# EAGLE design PRY237 - Laser Rec (EAGLE 8.3.2)
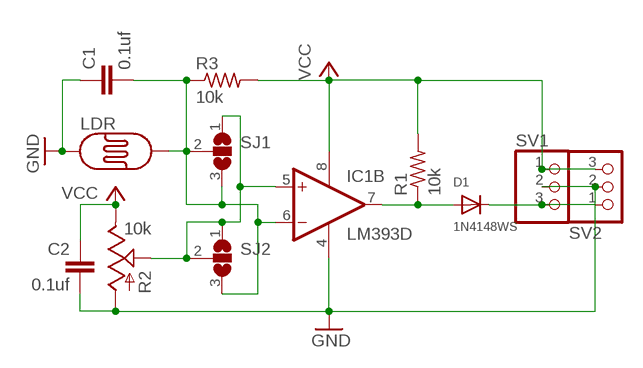
[diagram p0: schematic, sheet 1]

## Parts
C1  0.1uf  C-EUC0805  [C0805]
C2  0.1uf  C-EUC0805  [C0805]
D1  1N4148WS  DIODESOD-323F  [SOD-323F]
IC1  LM393D  [SO08]
LDR  PHOTOCELLPTH  [PHOTOCELL]
R1  10k  R-US_M0805  [M0805]
R2  10k  TRIM_US-CT6  [CT6]
R3  10k  R-US_M0805  [M0805]
SJ1  SJ2W  [SJ_2]
SJ2  SJ2W  [SJ_2]
SV1  PINHD-1X3  [1X03]
SV2  PINHD-1X3  [1X03]

## Nets
GND: C1.1 C2.2 IC1.4(P:V-) LDR.1 R2.A SV1.2 SV2.2
N$1: IC1.5(B:+IN) R2.S SJ1.1 SJ2.1 SJ2.2
N$2: D1.C SV1.3 SV2.1
N$3: D1.A IC1.7(B:OUT) R1.1
N$4: C1.2 IC1.6(B:-IN) LDR.2 R3.1 SJ1.2 SJ1.3 SJ2.3
VCC: C2.1 IC1.8(P:V+) R1.2 R2.E R3.2 SV1.1 SV2.3
Unconnected: IC1.1(A:OUT) IC1.2(A:-IN) IC1.3(A:+IN)

## Library data of the parts
C1 C2 = rcl:C-EU: CAPACITOR, European symbol
D1 = adafruit:DIODE: Diode SMADIODE - SMA Surface Mount Package 20V 1A Schottky Diode Digikey: 641-1014-6-ND DO-1N4148 - Through Hole Small Current Diode SOD-123 20V 1 A (.5mV Vf) Schottky Diode - Digikey: MBRX120TPMSCT-ND SOD-323 10V 570mA (.38mV Vf, 3ns) Schottky Diode - Digikey: ZLLS410CT-ND SOD-523 30V 30mA Schottky Diode (RB751S-40TE61) - Digikey: RB751S-40TE61CT-ND SOT23-R/W - SOT23 Package (R = Solder Paste/Reflow Ovens, W = Hand-Soldering) BAT54Film 40V 300mA - Digikey: 497-7162-1-ND
IC1 = linear:LM393: COMPARATOR
LDR = SparkFun-Sensors:PHOTOCELL: CdS photoresistor. This is a low cost way to detect light levels. Resistance decreases with more incoming light. SparkFun SKU: SEN-09088
R1 R3 = rcl:R-US_: RESISTOR, American symbol
R2 = pot:TRIM_US-: POTENTIOMETER
SJ1 SJ2 = jumper:SJ2W: SMD solder JUMPER
SV1 SV2 = pinhead:PINHD-1X3: PIN HEADER

## Board
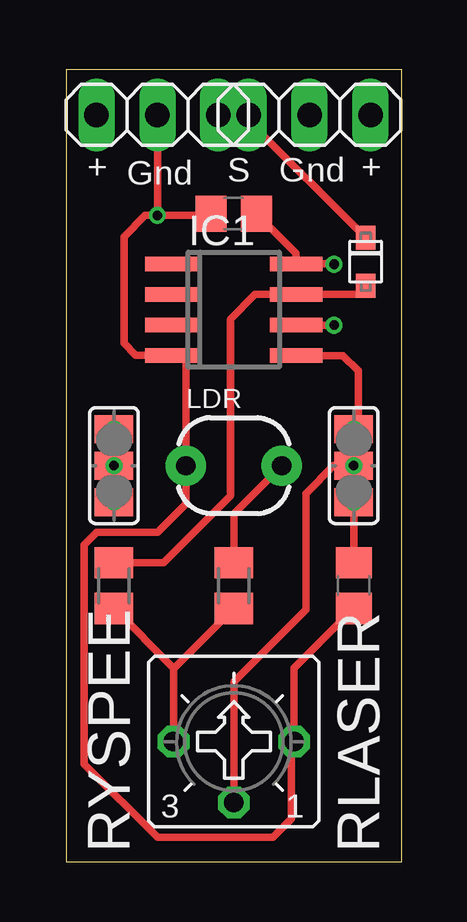
[diagram p1: board, top side]
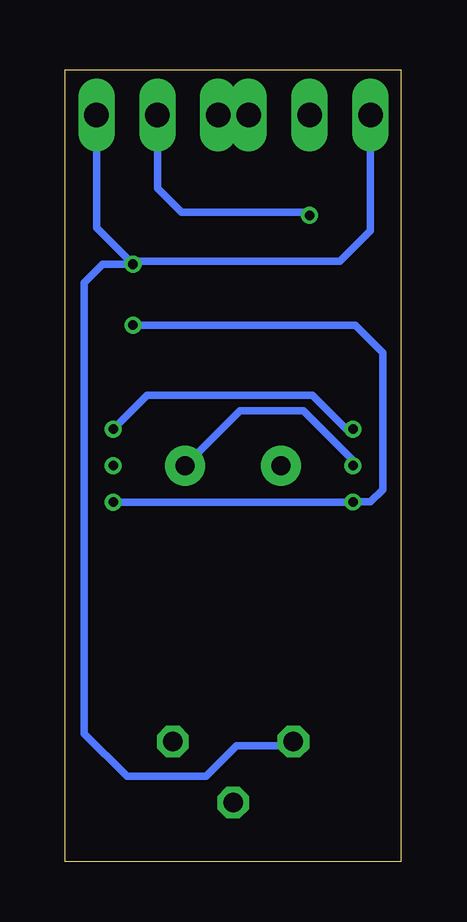
[diagram p2: board, bottom side, seen from below]

Size 14 x 33 mm. Coordinates in mm from the lower left corner, seen from the top.
Outline: 0,0 14,0 14,33 0,33 0,0
Copper layers (1*16): Top 0.035mm / dielectric 1.5mm / Bottom 0.035mm
Design rules "RYSPEE_2layer_DRU": minimum track width 6mil, minimum drill 12mil, track to track 6mil, track to pad 6mil, pad to pad 6mil, via to via 6mil, smd to smd 0mil, copper to edge 10mil, drill to drill 10mil, minimum pad ring 10mil, minimum via ring 6mil, stop-mask expansion 2mil, vias tented up to drill 100mil, thermal gap 10mil

### Footprints (pad centres in the part's own frame; a part is rotated, then mirrored left to right if it is on the bottom)
C0805 = smd 1.3 x 1.5: 1 -0.95,0; 2 0.95,0
SOD-323F = smd 1 x 0.8: A -1,0; C 1,0
SO08 = smd 0.6 x 2.2: 1 -1.905,-2.6; 2 -0.635,-2.6; 3 0.635,-2.6; 4 1.905,-2.6; 5 1.905,2.6; 6 0.635,2.6; 7 -0.635,2.6; 8 -1.905,2.6
PHOTOCELL = drill 0.8 pad 1.676: 1 -2,0; 2 2,0
M0805 = smd 1.3 x 1.6: 1 -0.95,0; 2 0.95,0
CT6 = drill 0.813 octagon: A 2.515,0; E -2.515,0; S 0,-2.54
SJ_2 = smd 1.168 x 1.6: 1 -1.524,0; 2 0,0; 3 1.524,0
1X03 = drill 1.016 long: 1 -2.54,0; 2 0,0; 3 2.54,0

### Placement (x,y rotation side)
C1  12,11.5 90 top
C2  7,27 180 top
D1  12.5,25 90 top
IC1  7,23 270 top
LDR  7,16.5 0 top
R1  2,11.5 270 top
R2  7,5 0 top
R3  7,11.5 270 top
SJ1  2,16.5 270 top
SJ2  12,16.5 270 top
SV1  3.81,31.11 0 top
SV2  10.16,31.11 0 top

### Tracks (layer width: path | path; a pad name or v marks a point on that pad's centre or on a via)
GND  (via drill 0.4)
  Top 0.305: C1.1 9.52,8.06 R2.A 9.4,4.88 9.4,1.78 8.64,1.02 3.81,1.02 0.76,4.06 0.76,13.21 1.27,13.72 3.81,13.72 5,14.91 LDR.1 5,21 4.5,21 IC1.4 2.91,21.09 2.41,21.59 2.41,26.04 3.3,26.92 v3.81,26.92 | v3.81,26.92 5.97,26.92 C2.2 | SV1.2 v3.81,26.92
  Bottom 0.305: SV2.2 10.16,28.07 9.14,27.05 3.94,27.05 v3.81,26.92
N$1  (via drill 0.4)
  Top 0.152: SJ2.1 SJ2.2
  Top 0.305: R2.S 7,7.5 10,10.5 10,15.33 11.18,16.51 SJ2.2 | IC1.5 9.61,21.08 11.56,21.08 12.19,20.45 12.19,18.22 SJ2.1
  Bottom 0.305: SJ1.1 2.28,18.02 3.68,19.43 10.59,19.43 SJ2.1
  other vias: 2,18.02 12,18.02 12,16.5
N$2
  Top 0.305: SV2.1 7.62,30.88 D1.C
  Bottom 0.305: SV1.3 SV2.1
N$3
  Top 0.305: D1.A 12.13,23.64 IC1.7 7.89,23.64 6.86,22.61 6.86,15.24 4.06,12.45 R1.1
N$4  (via drill 0.4)
  Top 0.152: SJ1.3 v2,14.99 SJ1.2
  Top 0.305: R3.1 7,14.5 LDR.2 | C1.2 SJ2.3 | v11.18,22.35 9.61,22.35 IC1.6
  Bottom 0.305: SJ1.2 2,16.73 4.06,18.8 6.7,18.8 LDR.2 | SJ2.3 SJ1.3 v2,14.99 1.27,14.99 0.76,15.49 0.76,21.21 1.91,22.35 v11.18,22.35
  other vias: 2,16.5 12,14.98
VCC  (via drill 0.4)
  Top 0.305: R2.E 4.49,8.04 | 4.49,8.04 R3.2 | 4.49,8.04 4.49,8.06 R1.2 | v11.18,24.89 11.16,24.91 IC1.8 9.6,25.35 C2.1
  Bottom 0.305: v11.18,24.89 12.45,24.89 13.21,24.13 13.21,5.33 11.43,3.56 8.13,3.56 6.86,4.83 4.66,4.83 R2.E | SV2.3 12.7,26.42 v11.18,24.89 | SV1.1 1.27,26.29 2.54,25.02 11.05,25.02 v11.18,24.89

### Text on the board
tPlace: + | Gnd | S | Gnd | + | RYSPEE | RLASER